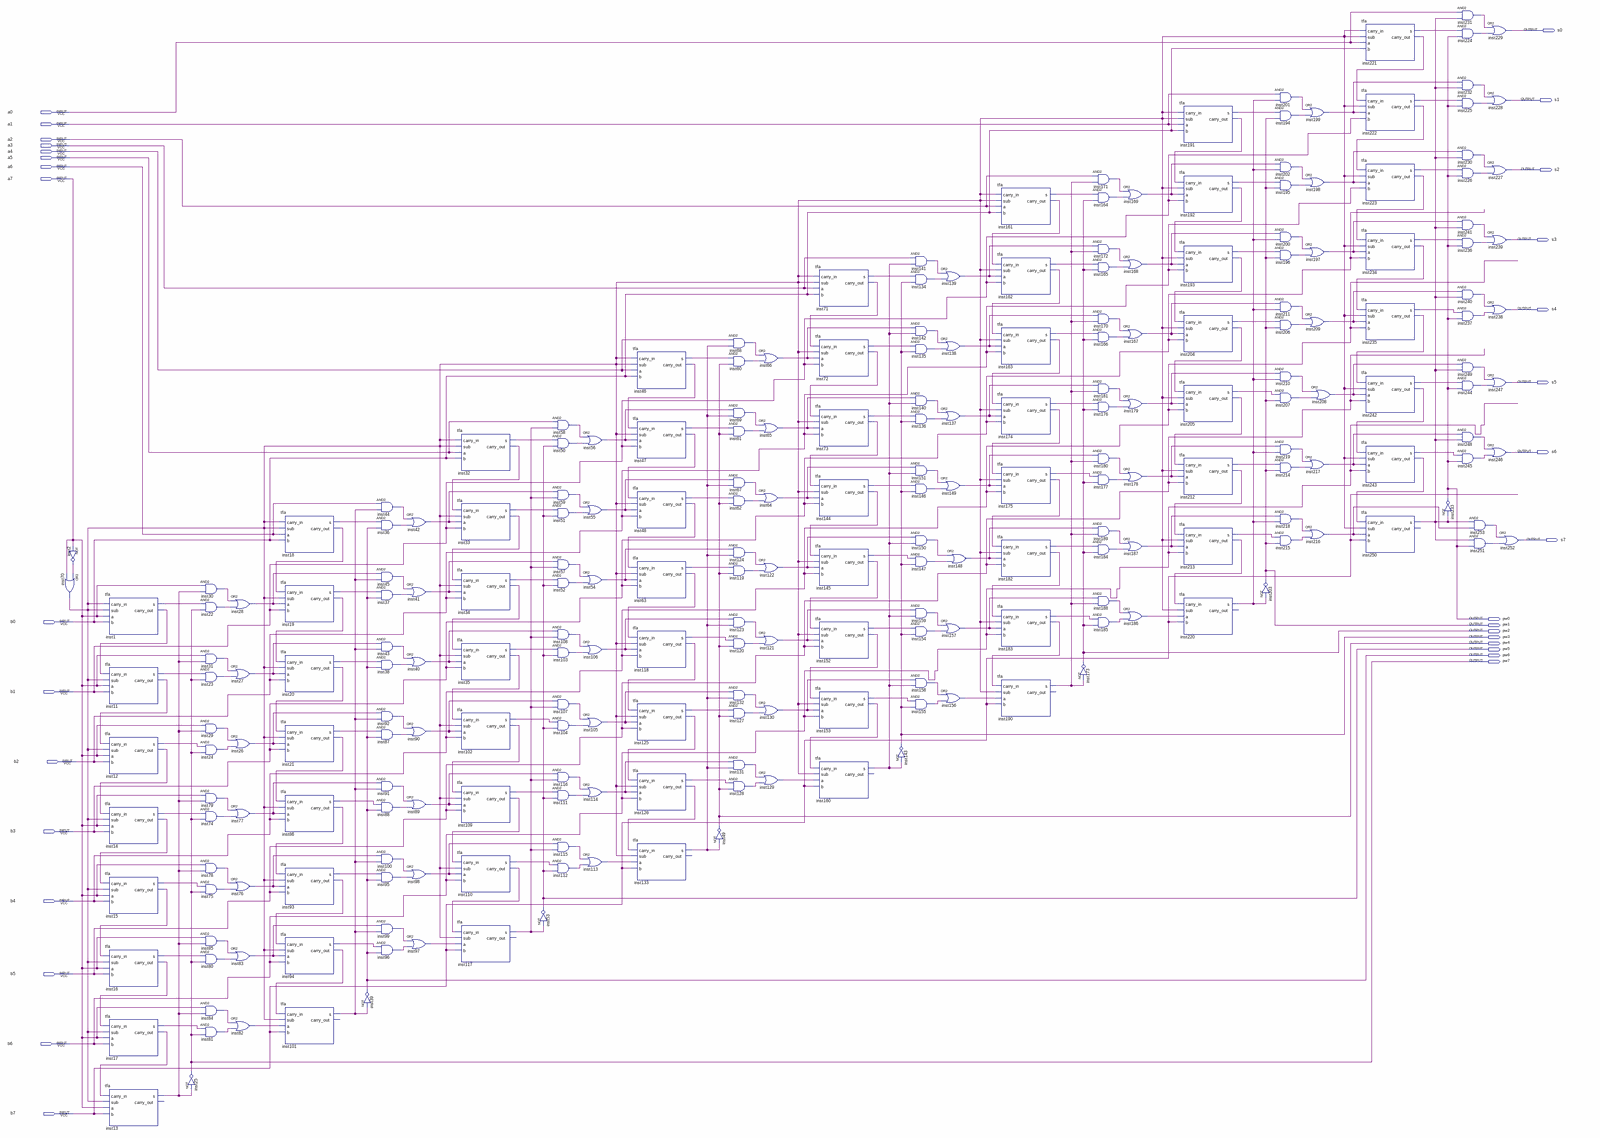
[diagram p0: schematic sheet, whole]
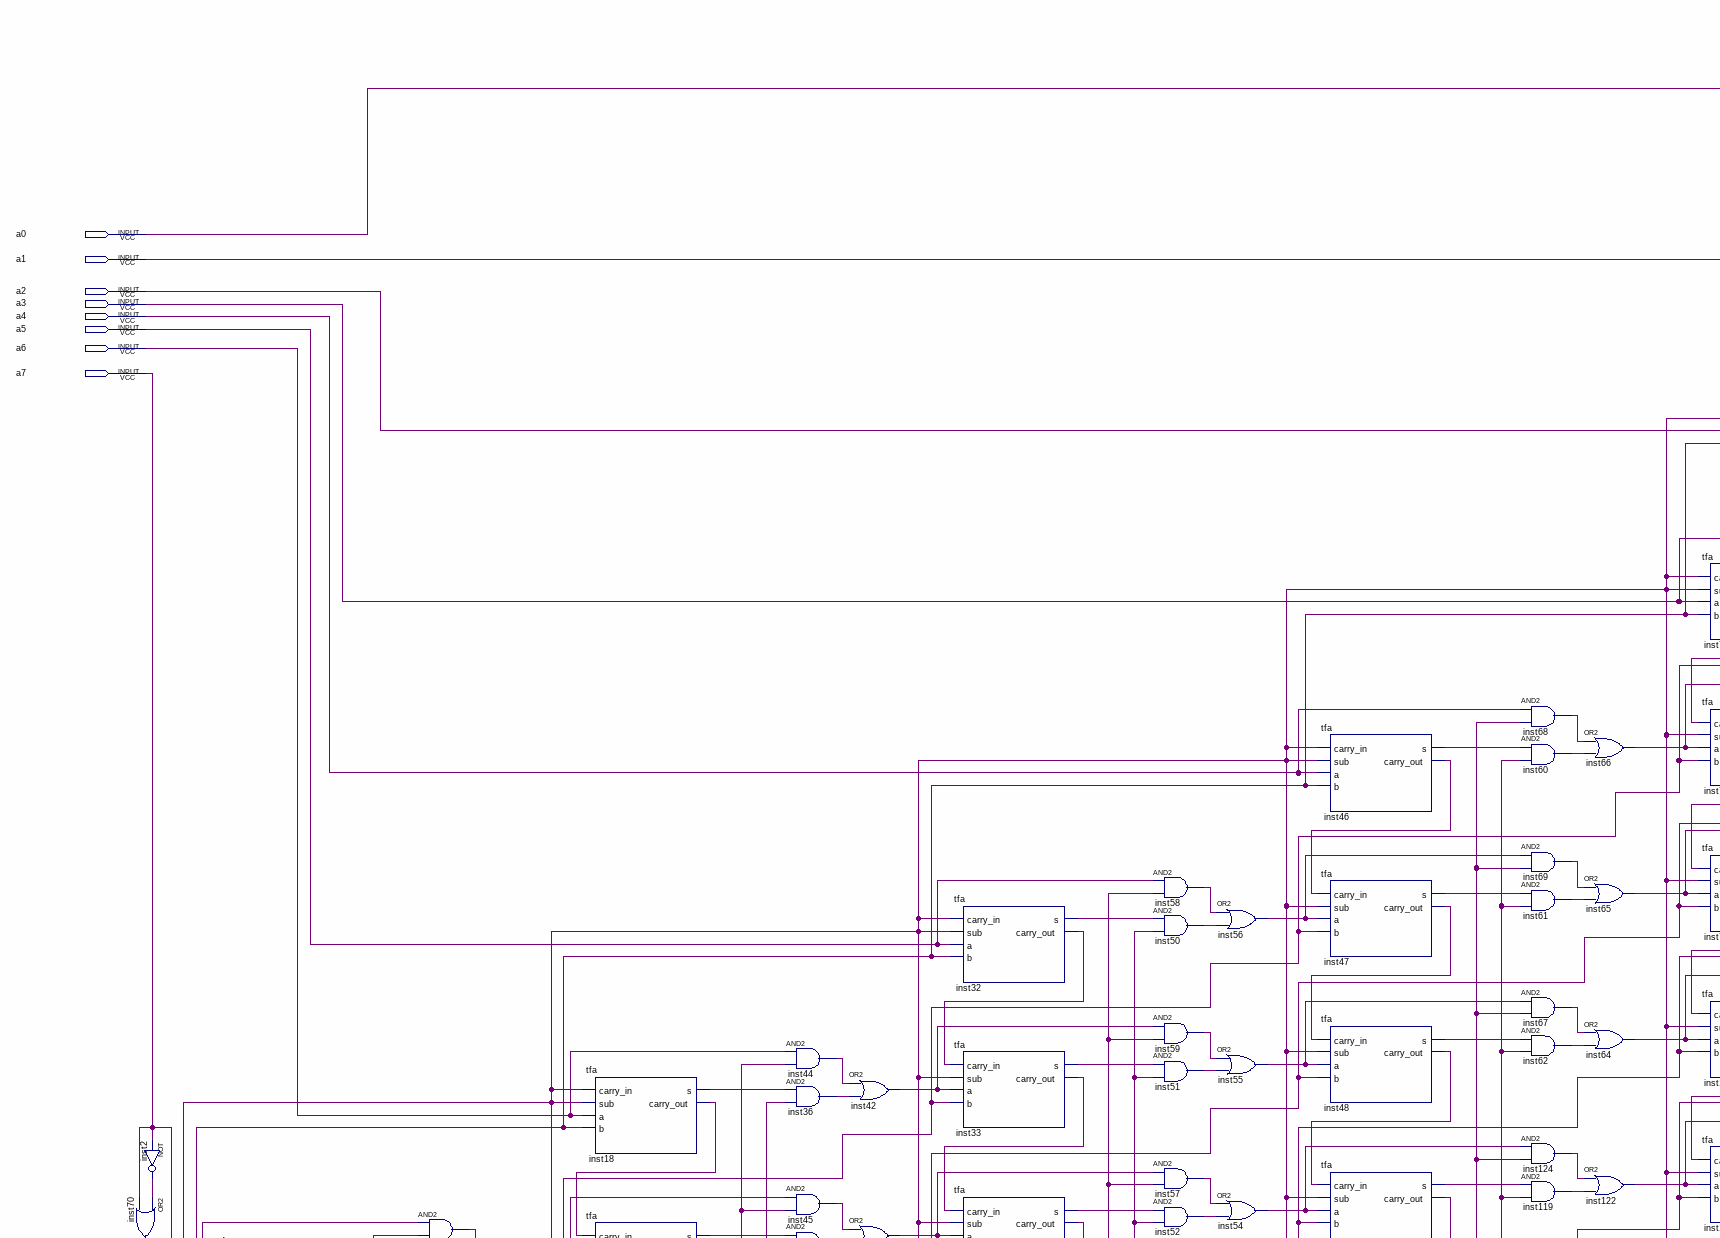
[diagram p1: schematic sheet, upper left part]
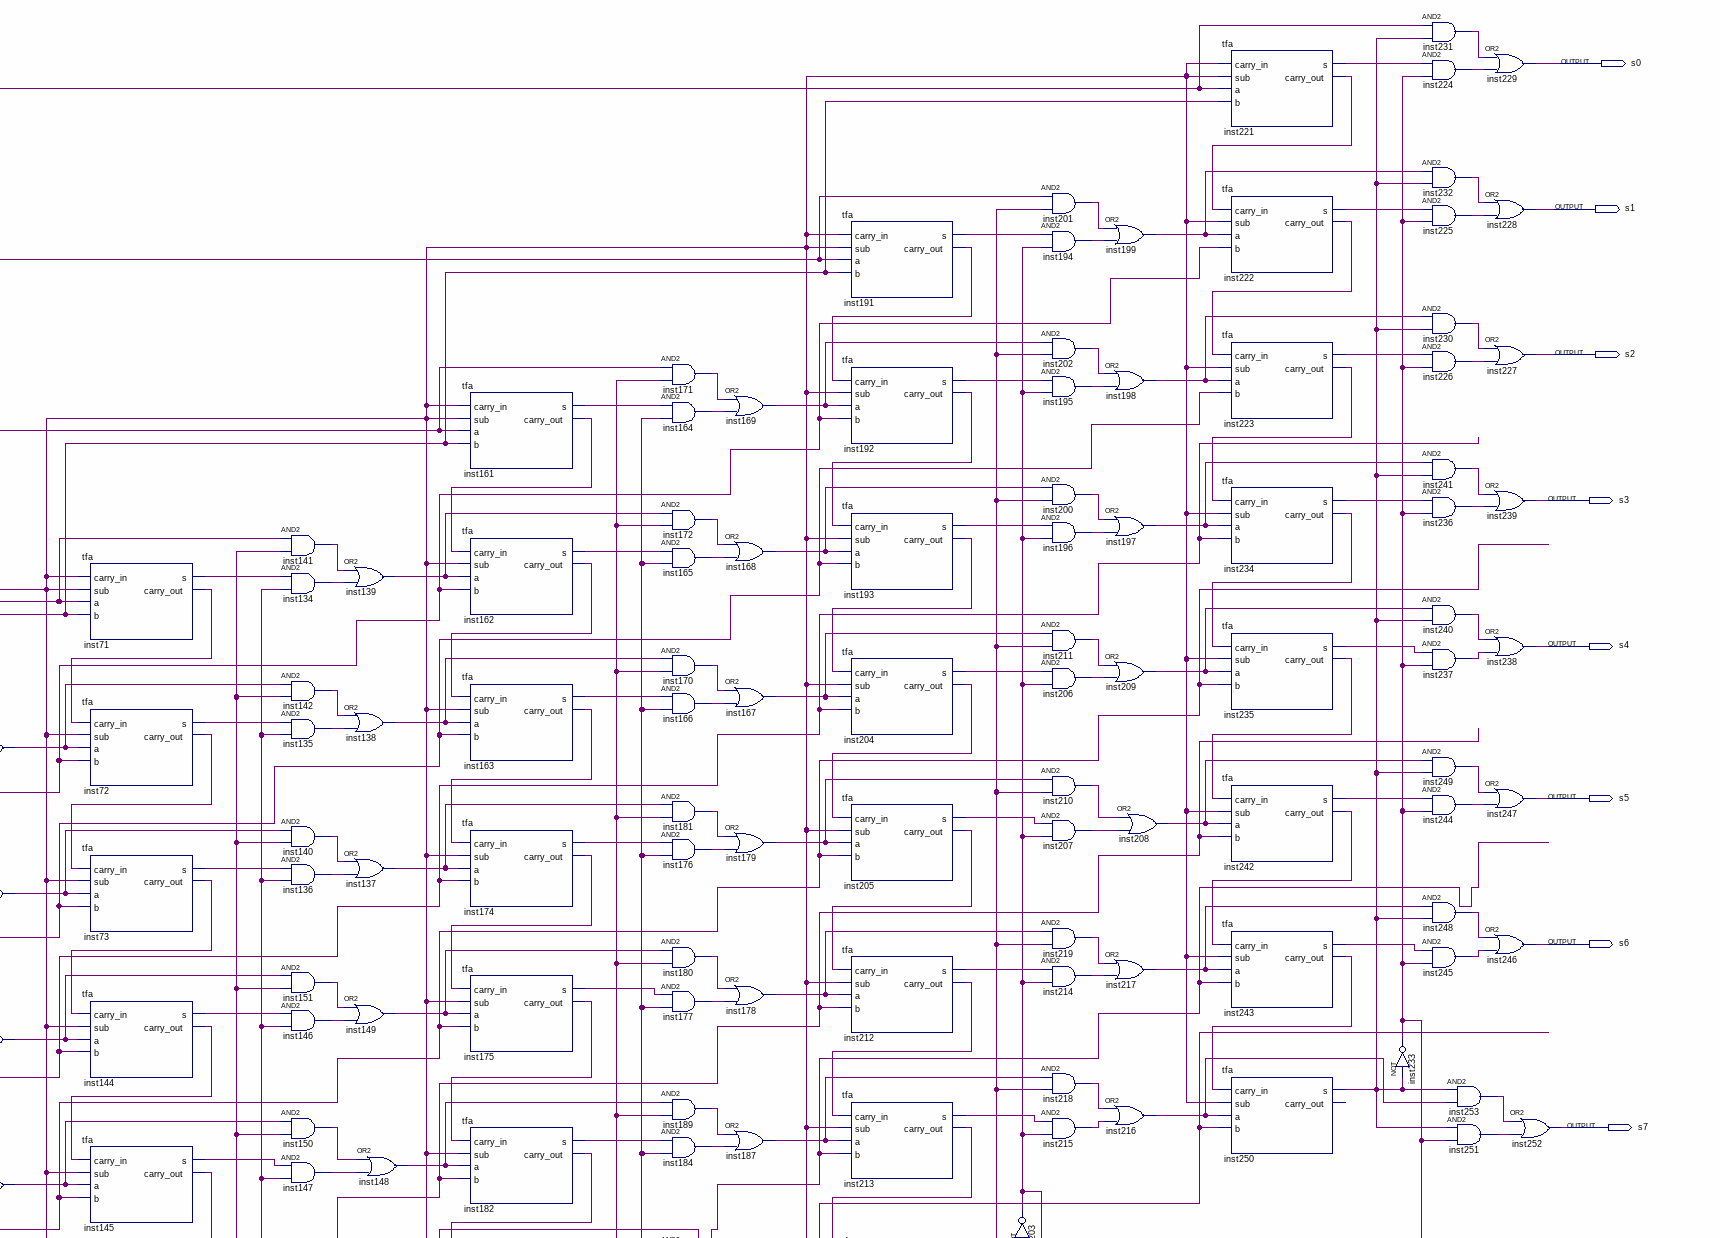
[diagram p2: schematic sheet, upper right part]
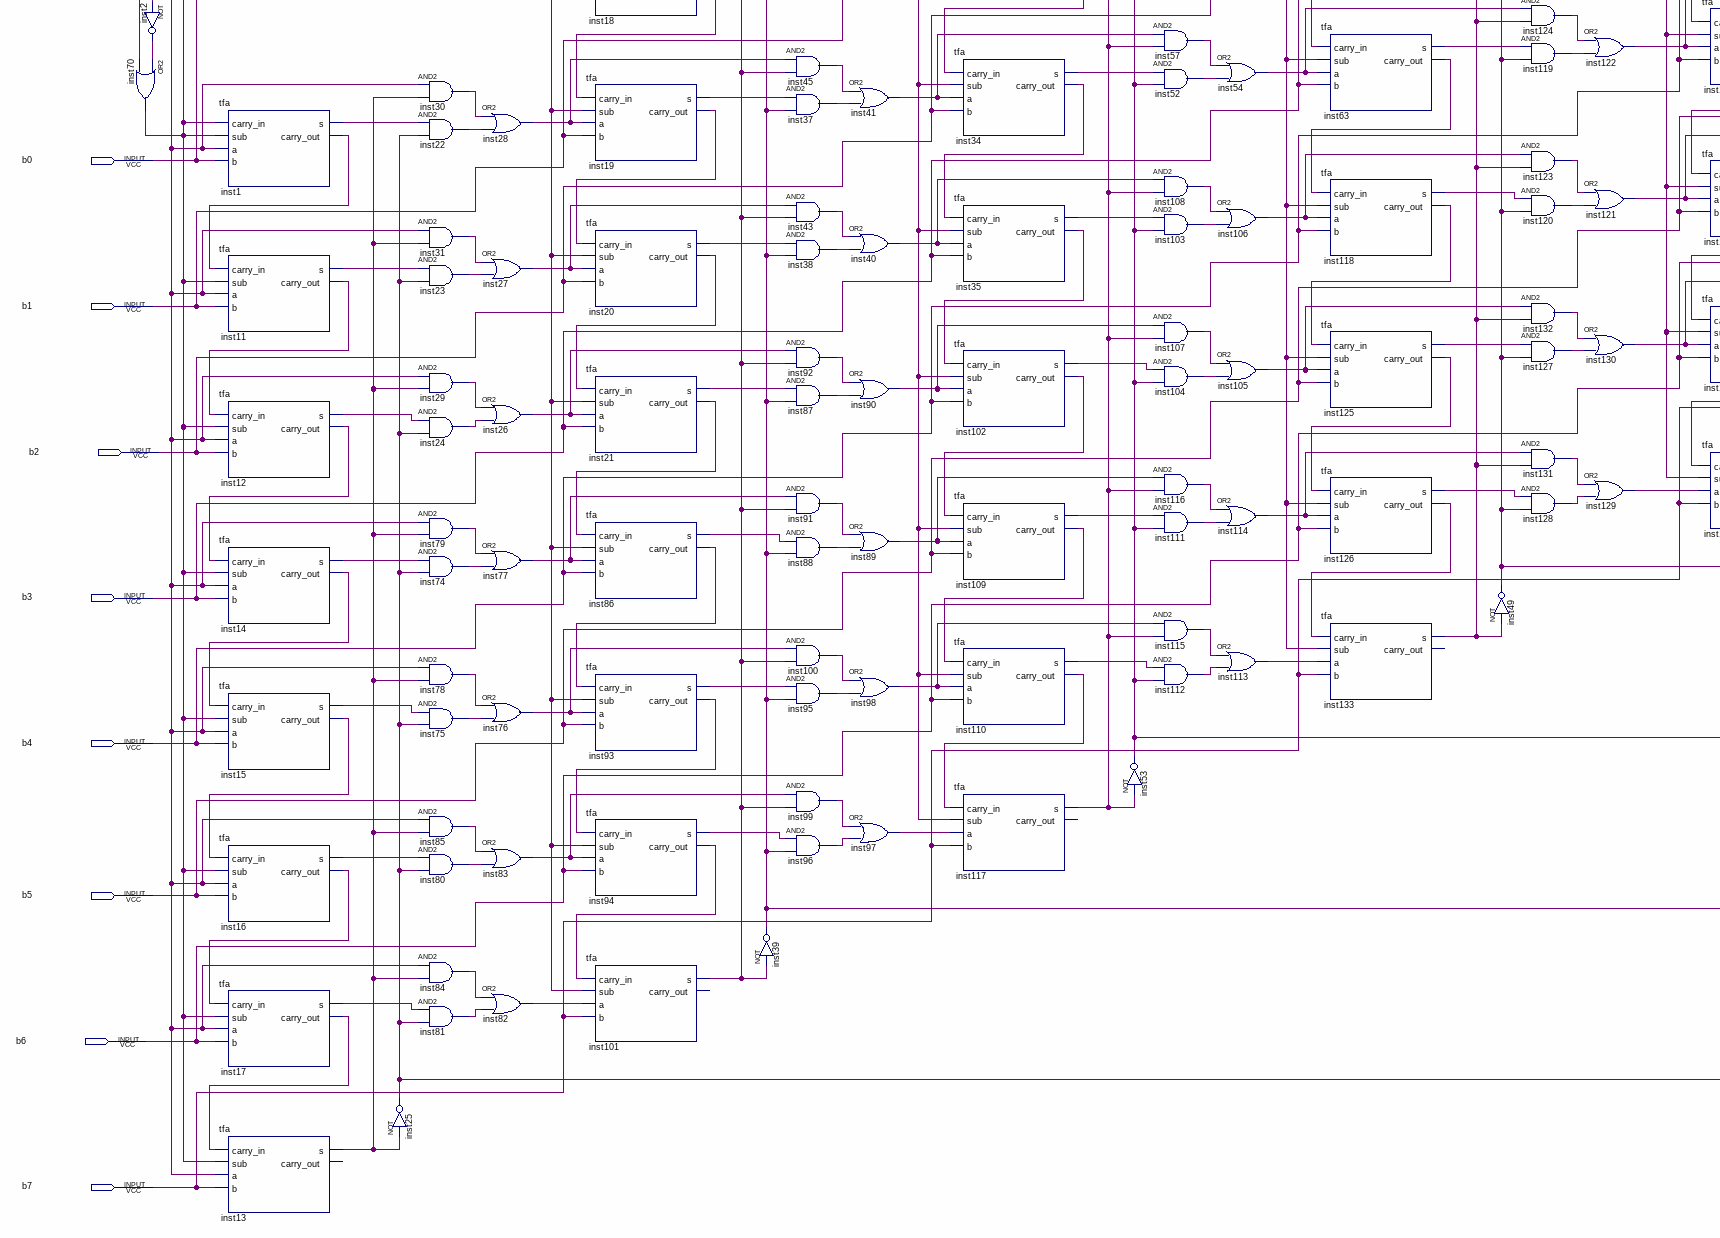
[diagram p3: schematic sheet, lower left part]
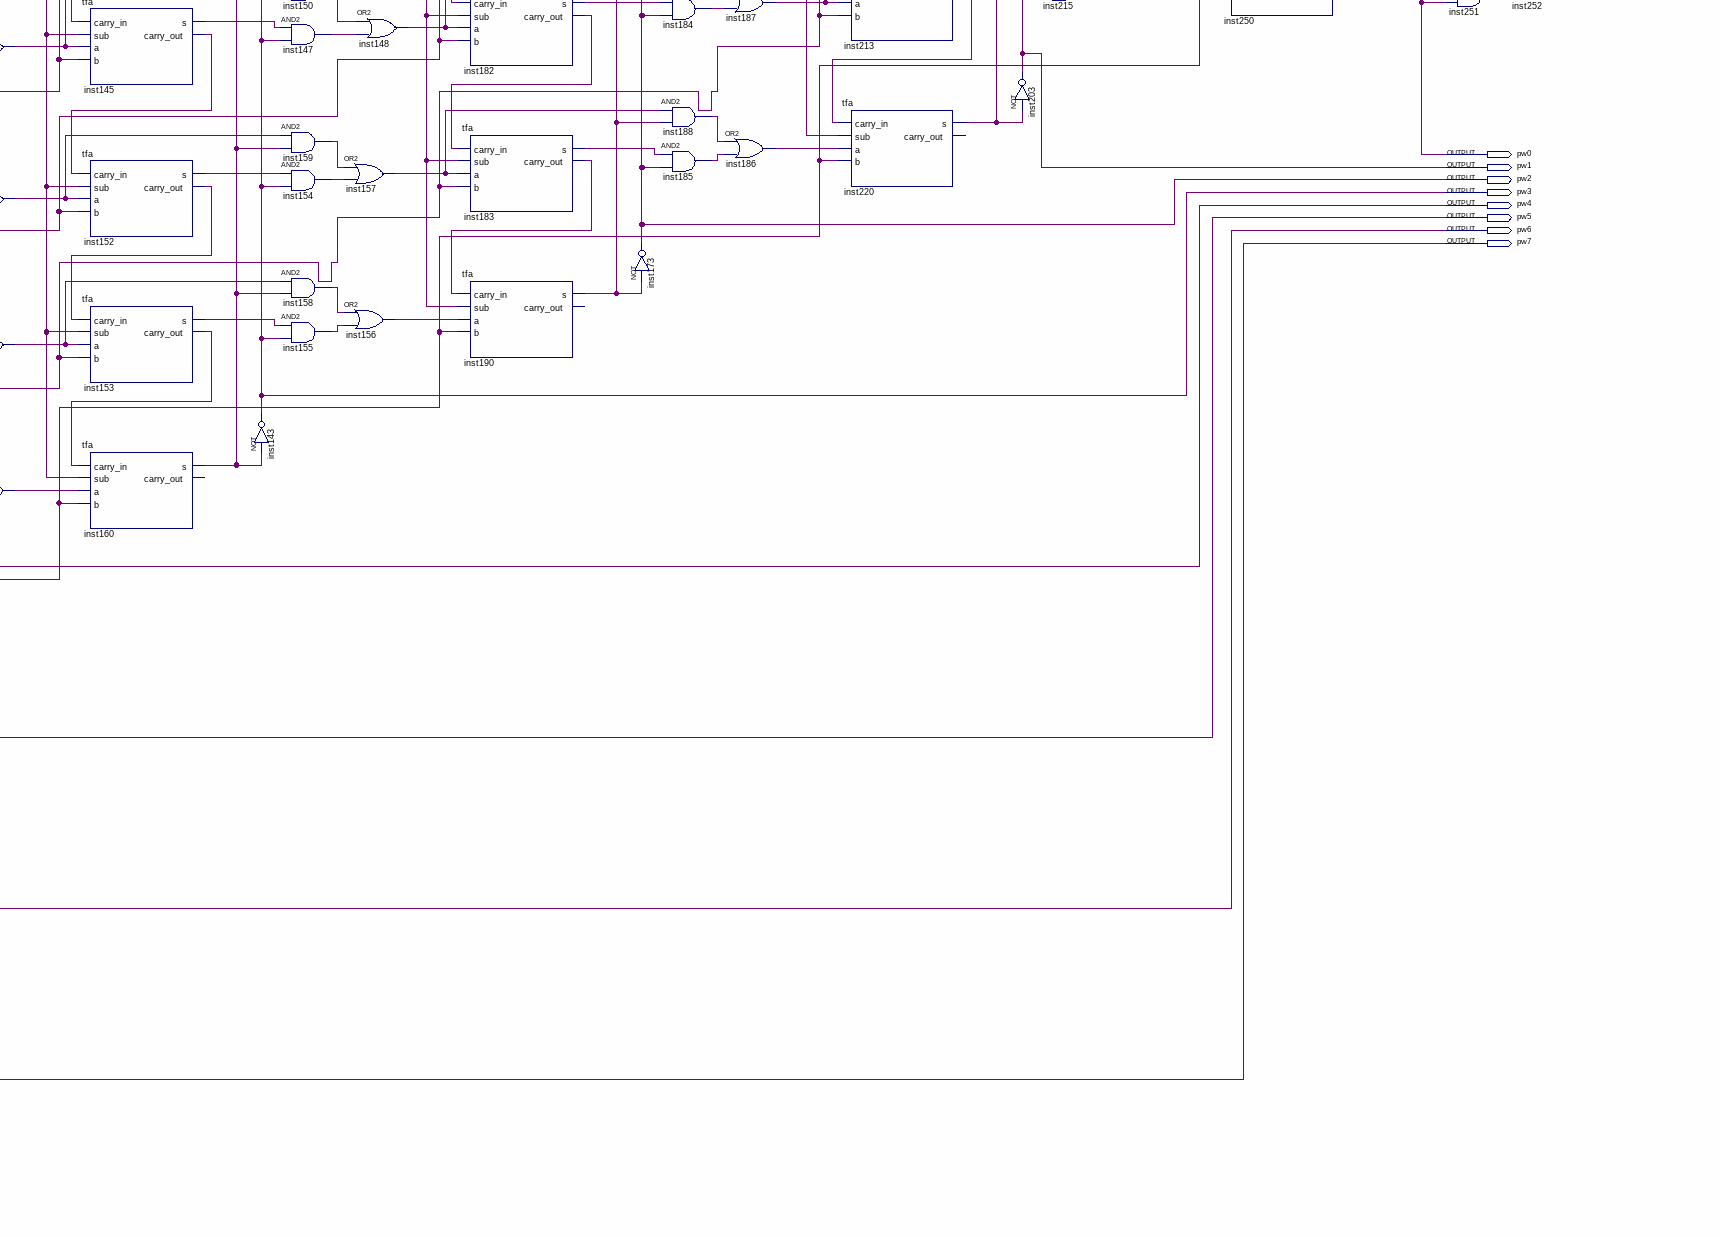
[diagram p4: schematic sheet, lower right part]
// Quartus schematic cfq1.bdf as structural Verilog: 245 symbols, 32 pins
module cfq1 (
  input  a0,
  input  a1,
  input  a2,
  input  a3,
  input  a4,
  input  a5,
  input  a6,
  input  a7,
  input  b0,
  input  b1,
  input  b2,
  input  b3,
  input  b4,
  input  b5,
  input  b6,
  input  b7,
  output s0,
  output s1,
  output s2,
  output s3,
  output s4,
  output s5,
  output s6,
  output s7,
  output pw0,
  output pw1,
  output pw2,
  output pw3,
  output pw4,
  output pw5,
  output pw6,
  output pw7
);

  wire inst1_carry_out, inst1_s, inst2_out, inst11_carry_out, inst11_s, inst12_carry_out, inst12_s, inst13_s,
       inst14_carry_out, inst14_s, inst15_carry_out, inst15_s, inst16_carry_out, inst16_s, inst17_carry_out,
       inst17_s, inst18_carry_out, inst18_s, inst19_carry_out, inst19_s, inst20_carry_out, inst20_s,
       inst21_carry_out, inst21_s, inst22_out, inst23_out, inst24_out, inst26_out, inst27_out, inst28_out,
       inst29_out, inst30_out, inst31_out, inst32_carry_out, inst32_s, inst33_carry_out, inst33_s,
       inst34_carry_out, inst34_s, inst35_carry_out, inst35_s, inst36_out, inst37_out, inst38_out,
       inst40_out, inst41_out, inst42_out, inst43_out, inst44_out, inst45_out, inst46_carry_out, inst46_s,
       inst47_carry_out, inst47_s, inst48_carry_out, inst48_s, inst50_out, inst51_out, inst52_out,
       inst54_out, inst55_out, inst56_out, inst57_out, inst58_out, inst59_out, inst60_out, inst61_out,
       inst62_out, inst63_carry_out, inst63_s, inst64_out, inst65_out, inst66_out, inst67_out, inst68_out,
       inst69_out, inst70_out, inst71_carry_out, inst71_s, inst72_carry_out, inst72_s, inst73_carry_out,
       inst73_s, inst74_out, inst75_out, inst76_out, inst77_out, inst78_out, inst79_out, inst80_out,
       inst81_out, inst82_out, inst83_out, inst84_out, inst85_out, inst86_carry_out, inst86_s, inst87_out,
       inst88_out, inst89_out, inst90_out, inst91_out, inst92_out, inst93_carry_out, inst93_s,
       inst94_carry_out, inst94_s, inst95_out, inst96_out, inst97_out, inst98_out, inst99_out, inst100_out,
       inst101_s, inst102_carry_out, inst102_s, inst103_out, inst104_out, inst105_out, inst106_out,
       inst107_out, inst108_out, inst109_carry_out, inst109_s, inst110_carry_out, inst110_s, inst111_out,
       inst112_out, inst113_out, inst114_out, inst115_out, inst116_out, inst117_s, inst118_carry_out,
       inst118_s, inst119_out, inst120_out, inst121_out, inst122_out, inst123_out, inst124_out,
       inst125_carry_out, inst125_s, inst126_carry_out, inst126_s, inst127_out, inst128_out, inst129_out,
       inst130_out, inst131_out, inst132_out, inst133_s, inst134_out, inst135_out, inst136_out, inst137_out,
       inst138_out, inst139_out, inst140_out, inst141_out, inst142_out, inst144_carry_out, inst144_s,
       inst145_carry_out, inst145_s, inst146_out, inst147_out, inst148_out, inst149_out, inst150_out,
       inst151_out, inst152_carry_out, inst152_s, inst153_carry_out, inst153_s, inst154_out, inst155_out,
       inst156_out, inst157_out, inst158_out, inst159_out, inst160_s, inst161_carry_out, inst161_s,
       inst162_carry_out, inst162_s, inst163_carry_out, inst163_s, inst164_out, inst165_out, inst166_out,
       inst167_out, inst168_out, inst169_out, inst170_out, inst171_out, inst172_out, inst174_carry_out,
       inst174_s, inst175_carry_out, inst175_s, inst176_out, inst177_out, inst178_out, inst179_out,
       inst180_out, inst181_out, inst182_carry_out, inst182_s, inst183_carry_out, inst183_s, inst184_out,
       inst185_out, inst186_out, inst187_out, inst188_out, inst189_out, inst190_s, inst191_carry_out,
       inst191_s, inst192_carry_out, inst192_s, inst193_carry_out, inst193_s, inst194_out, inst195_out,
       inst196_out, inst197_out, inst198_out, inst199_out, inst200_out, inst201_out, inst202_out,
       inst204_carry_out, inst204_s, inst205_carry_out, inst205_s, inst206_out, inst207_out, inst208_out,
       inst209_out, inst210_out, inst211_out, inst212_carry_out, inst212_s, inst213_carry_out, inst213_s,
       inst214_out, inst215_out, inst216_out, inst217_out, inst218_out, inst219_out, inst220_s,
       inst221_carry_out, inst221_s, inst222_carry_out, inst222_s, inst223_carry_out, inst223_s, inst224_out,
       inst225_out, inst226_out, inst230_out, inst231_out, inst232_out, inst234_carry_out, inst234_s,
       inst235_carry_out, inst235_s, inst236_out, inst237_out, inst240_out, inst241_out, inst242_carry_out,
       inst242_s, inst243_carry_out, inst243_s, inst244_out, inst245_out, inst248_out, inst249_out,
       inst250_s, inst251_out, inst253_out;

  or inst70 (inst70_out, inst2_out, a7);
  not inst2 (inst2_out, a7);
  tfa inst1 (.carry_in(inst70_out), .sub(inst70_out), .a(a7), .b(b0), .s(inst1_s), .carry_out(inst1_carry_out));
  tfa inst11 (.carry_in(inst1_carry_out), .sub(inst70_out), .a(a7), .b(b1), .s(inst11_s), .carry_out(inst11_carry_out));
  tfa inst12 (
    .carry_in(inst11_carry_out), .sub(inst70_out), .a(a7), .b(b2), .s(inst12_s), .carry_out(inst12_carry_out));
  tfa inst14 (
    .carry_in(inst12_carry_out), .sub(inst70_out), .a(a7), .b(b3), .s(inst14_s), .carry_out(inst14_carry_out));
  tfa inst15 (
    .carry_in(inst14_carry_out), .sub(inst70_out), .a(a7), .b(b4), .s(inst15_s), .carry_out(inst15_carry_out));
  tfa inst16 (
    .carry_in(inst15_carry_out), .sub(inst70_out), .a(a7), .b(b5), .s(inst16_s), .carry_out(inst16_carry_out));
  tfa inst17 (
    .carry_in(inst16_carry_out), .sub(inst70_out), .a(a7), .b(b6), .s(inst17_s), .carry_out(inst17_carry_out));
  tfa inst13 (.carry_in(inst17_carry_out), .sub(inst70_out), .a(a7), .b(b7), .s(inst13_s));  // open: carry_out
  and inst30 (inst30_out, a7, inst13_s);
  and inst22 (inst22_out, inst1_s, pw7);
  and inst31 (inst31_out, a7, inst13_s);
  and inst23 (inst23_out, inst11_s, pw7);
  and inst29 (inst29_out, a7, inst13_s);
  and inst24 (inst24_out, inst12_s, pw7);
  and inst79 (inst79_out, a7, inst13_s);
  and inst74 (inst74_out, inst14_s, pw7);
  and inst78 (inst78_out, a7, inst13_s);
  and inst75 (inst75_out, inst15_s, pw7);
  and inst85 (inst85_out, a7, inst13_s);
  and inst80 (inst80_out, inst16_s, pw7);
  and inst84 (inst84_out, a7, inst13_s);
  and inst81 (inst81_out, inst17_s, pw7);
  not inst25 (pw7, inst13_s);
  or inst28 (inst28_out, inst30_out, inst22_out);
  or inst27 (inst27_out, inst31_out, inst23_out);
  or inst26 (inst26_out, inst29_out, inst24_out);
  or inst77 (inst77_out, inst79_out, inst74_out);
  or inst76 (inst76_out, inst78_out, inst75_out);
  or inst83 (inst83_out, inst85_out, inst80_out);
  or inst82 (inst82_out, inst84_out, inst81_out);
  tfa inst18 (.carry_in(inst70_out), .sub(inst70_out), .a(a6), .b(b0), .s(inst18_s), .carry_out(inst18_carry_out));
  tfa inst19 (
    .carry_in(inst18_carry_out), .sub(inst70_out), .a(inst28_out), .b(b1), .s(inst19_s),
    .carry_out(inst19_carry_out));
  tfa inst20 (
    .carry_in(inst19_carry_out), .sub(inst70_out), .a(inst27_out), .b(b2), .s(inst20_s),
    .carry_out(inst20_carry_out));
  tfa inst21 (
    .carry_in(inst20_carry_out), .sub(inst70_out), .a(inst26_out), .b(b3), .s(inst21_s),
    .carry_out(inst21_carry_out));
  tfa inst86 (
    .carry_in(inst21_carry_out), .sub(inst70_out), .a(inst77_out), .b(b4), .s(inst86_s),
    .carry_out(inst86_carry_out));
  tfa inst93 (
    .carry_in(inst86_carry_out), .sub(inst70_out), .a(inst76_out), .b(b5), .s(inst93_s),
    .carry_out(inst93_carry_out));
  tfa inst94 (
    .carry_in(inst93_carry_out), .sub(inst70_out), .a(inst83_out), .b(b6), .s(inst94_s),
    .carry_out(inst94_carry_out));
  tfa inst101 (
    .carry_in(inst94_carry_out), .sub(inst70_out), .a(inst82_out), .b(b7), .s(inst101_s));  // open: carry_out
  and inst44 (inst44_out, a6, inst101_s);
  and inst36 (inst36_out, inst18_s, pw6);
  and inst45 (inst45_out, inst28_out, inst101_s);
  and inst37 (inst37_out, inst19_s, pw6);
  and inst43 (inst43_out, inst27_out, inst101_s);
  and inst38 (inst38_out, inst20_s, pw6);
  and inst92 (inst92_out, inst26_out, inst101_s);
  and inst87 (inst87_out, inst21_s, pw6);
  and inst91 (inst91_out, inst77_out, inst101_s);
  and inst88 (inst88_out, inst86_s, pw6);
  and inst100 (inst100_out, inst76_out, inst101_s);
  and inst95 (inst95_out, inst93_s, pw6);
  and inst99 (inst99_out, inst83_out, inst101_s);
  and inst96 (inst96_out, inst94_s, pw6);
  not inst39 (pw6, inst101_s);
  or inst42 (inst42_out, inst44_out, inst36_out);
  or inst41 (inst41_out, inst45_out, inst37_out);
  or inst40 (inst40_out, inst43_out, inst38_out);
  or inst90 (inst90_out, inst92_out, inst87_out);
  or inst89 (inst89_out, inst91_out, inst88_out);
  or inst98 (inst98_out, inst100_out, inst95_out);
  or inst97 (inst97_out, inst99_out, inst96_out);
  tfa inst32 (.carry_in(inst70_out), .sub(inst70_out), .a(a5), .b(b0), .s(inst32_s), .carry_out(inst32_carry_out));
  tfa inst33 (
    .carry_in(inst32_carry_out), .sub(inst70_out), .a(inst42_out), .b(b1), .s(inst33_s),
    .carry_out(inst33_carry_out));
  tfa inst34 (
    .carry_in(inst33_carry_out), .sub(inst70_out), .a(inst41_out), .b(b2), .s(inst34_s),
    .carry_out(inst34_carry_out));
  tfa inst35 (
    .carry_in(inst34_carry_out), .sub(inst70_out), .a(inst40_out), .b(b3), .s(inst35_s),
    .carry_out(inst35_carry_out));
  tfa inst102 (
    .carry_in(inst35_carry_out), .sub(inst70_out), .a(inst90_out), .b(b4), .s(inst102_s),
    .carry_out(inst102_carry_out));
  tfa inst109 (
    .carry_in(inst102_carry_out), .sub(inst70_out), .a(inst89_out), .b(b5), .s(inst109_s),
    .carry_out(inst109_carry_out));
  tfa inst110 (
    .carry_in(inst109_carry_out), .sub(inst70_out), .a(inst98_out), .b(b6), .s(inst110_s),
    .carry_out(inst110_carry_out));
  tfa inst117 (
    .carry_in(inst110_carry_out), .sub(inst70_out), .a(inst97_out), .b(b7), .s(inst117_s));  // open: carry_out
  not inst53 (pw5, inst117_s);
  and inst58 (inst58_out, a5, inst117_s);
  and inst50 (inst50_out, inst32_s, pw5);
  and inst59 (inst59_out, inst42_out, inst117_s);
  and inst51 (inst51_out, inst33_s, pw5);
  and inst57 (inst57_out, inst41_out, inst117_s);
  and inst52 (inst52_out, inst34_s, pw5);
  and inst108 (inst108_out, inst40_out, inst117_s);
  and inst103 (inst103_out, inst35_s, pw5);
  and inst107 (inst107_out, inst90_out, inst117_s);
  and inst104 (inst104_out, inst102_s, pw5);
  and inst116 (inst116_out, inst89_out, inst117_s);
  and inst111 (inst111_out, inst109_s, pw5);
  and inst115 (inst115_out, inst98_out, inst117_s);
  and inst112 (inst112_out, inst110_s, pw5);
  or inst56 (inst56_out, inst58_out, inst50_out);
  or inst55 (inst55_out, inst59_out, inst51_out);
  or inst54 (inst54_out, inst57_out, inst52_out);
  or inst106 (inst106_out, inst108_out, inst103_out);
  or inst105 (inst105_out, inst107_out, inst104_out);
  or inst114 (inst114_out, inst116_out, inst111_out);
  or inst113 (inst113_out, inst115_out, inst112_out);
  tfa inst46 (.carry_in(inst70_out), .sub(inst70_out), .a(a4), .b(b0), .s(inst46_s), .carry_out(inst46_carry_out));
  tfa inst47 (
    .carry_in(inst46_carry_out), .sub(inst70_out), .a(inst56_out), .b(b1), .s(inst47_s),
    .carry_out(inst47_carry_out));
  tfa inst48 (
    .carry_in(inst47_carry_out), .sub(inst70_out), .a(inst55_out), .b(b2), .s(inst48_s),
    .carry_out(inst48_carry_out));
  tfa inst63 (
    .carry_in(inst48_carry_out), .sub(inst70_out), .a(inst54_out), .b(b3), .s(inst63_s),
    .carry_out(inst63_carry_out));
  tfa inst118 (
    .carry_in(inst63_carry_out), .sub(inst70_out), .a(inst106_out), .b(b4), .s(inst118_s),
    .carry_out(inst118_carry_out));
  tfa inst125 (
    .carry_in(inst118_carry_out), .sub(inst70_out), .a(inst105_out), .b(b5), .s(inst125_s),
    .carry_out(inst125_carry_out));
  tfa inst126 (
    .carry_in(inst125_carry_out), .sub(inst70_out), .a(inst114_out), .b(b6), .s(inst126_s),
    .carry_out(inst126_carry_out));
  tfa inst133 (
    .carry_in(inst126_carry_out), .sub(inst70_out), .a(inst113_out), .b(b7), .s(inst133_s));  // open: carry_out
  not inst49 (pw4, inst133_s);
  and inst68 (inst68_out, a4, inst133_s);
  and inst60 (inst60_out, inst46_s, pw4);
  and inst69 (inst69_out, inst56_out, inst133_s);
  and inst61 (inst61_out, inst47_s, pw4);
  and inst67 (inst67_out, inst55_out, inst133_s);
  and inst62 (inst62_out, inst48_s, pw4);
  and inst124 (inst124_out, inst54_out, inst133_s);
  and inst119 (inst119_out, inst63_s, pw4);
  and inst123 (inst123_out, inst106_out, inst133_s);
  and inst120 (inst120_out, inst118_s, pw4);
  and inst132 (inst132_out, inst105_out, inst133_s);
  and inst127 (inst127_out, inst125_s, pw4);
  and inst131 (inst131_out, inst114_out, inst133_s);
  and inst128 (inst128_out, inst126_s, pw4);
  or inst66 (inst66_out, inst68_out, inst60_out);
  or inst65 (inst65_out, inst69_out, inst61_out);
  or inst64 (inst64_out, inst67_out, inst62_out);
  or inst122 (inst122_out, inst124_out, inst119_out);
  or inst121 (inst121_out, inst123_out, inst120_out);
  or inst130 (inst130_out, inst132_out, inst127_out);
  or inst129 (inst129_out, inst131_out, inst128_out);
  tfa inst71 (.carry_in(inst70_out), .sub(inst70_out), .a(a3), .b(b0), .s(inst71_s), .carry_out(inst71_carry_out));
  tfa inst72 (
    .carry_in(inst71_carry_out), .sub(inst70_out), .a(inst66_out), .b(b1), .s(inst72_s),
    .carry_out(inst72_carry_out));
  tfa inst73 (
    .carry_in(inst72_carry_out), .sub(inst70_out), .a(inst65_out), .b(b2), .s(inst73_s),
    .carry_out(inst73_carry_out));
  tfa inst144 (
    .carry_in(inst73_carry_out), .sub(inst70_out), .a(inst64_out), .b(b3), .s(inst144_s),
    .carry_out(inst144_carry_out));
  tfa inst145 (
    .carry_in(inst144_carry_out), .sub(inst70_out), .a(inst122_out), .b(b4), .s(inst145_s),
    .carry_out(inst145_carry_out));
  tfa inst152 (
    .carry_in(inst145_carry_out), .sub(inst70_out), .a(inst121_out), .b(b5), .s(inst152_s),
    .carry_out(inst152_carry_out));
  tfa inst153 (
    .carry_in(inst152_carry_out), .sub(inst70_out), .a(inst130_out), .b(b6), .s(inst153_s),
    .carry_out(inst153_carry_out));
  tfa inst160 (
    .carry_in(inst153_carry_out), .sub(inst70_out), .a(inst129_out), .b(b7), .s(inst160_s));  // open: carry_out
  and inst141 (inst141_out, a3, inst160_s);
  and inst134 (inst134_out, inst71_s, pw3);
  and inst142 (inst142_out, inst66_out, inst160_s);
  and inst135 (inst135_out, inst72_s, pw3);
  and inst140 (inst140_out, inst65_out, inst160_s);
  and inst136 (inst136_out, inst73_s, pw3);
  and inst151 (inst151_out, inst64_out, inst160_s);
  and inst146 (inst146_out, inst144_s, pw3);
  and inst150 (inst150_out, inst122_out, inst160_s);
  and inst147 (inst147_out, inst145_s, pw3);
  and inst159 (inst159_out, inst121_out, inst160_s);
  and inst154 (inst154_out, inst152_s, pw3);
  and inst158 (inst158_out, inst130_out, inst160_s);
  and inst155 (inst155_out, inst153_s, pw3);
  not inst143 (pw3, inst160_s);
  or inst139 (inst139_out, inst141_out, inst134_out);
  or inst138 (inst138_out, inst142_out, inst135_out);
  or inst137 (inst137_out, inst140_out, inst136_out);
  or inst149 (inst149_out, inst151_out, inst146_out);
  or inst148 (inst148_out, inst150_out, inst147_out);
  or inst157 (inst157_out, inst159_out, inst154_out);
  or inst156 (inst156_out, inst158_out, inst155_out);
  tfa inst161 (.carry_in(inst70_out), .sub(inst70_out), .a(a2), .b(b0), .s(inst161_s), .carry_out(inst161_carry_out));
  tfa inst162 (
    .carry_in(inst161_carry_out), .sub(inst70_out), .a(inst139_out), .b(b1), .s(inst162_s),
    .carry_out(inst162_carry_out));
  tfa inst163 (
    .carry_in(inst162_carry_out), .sub(inst70_out), .a(inst138_out), .b(b2), .s(inst163_s),
    .carry_out(inst163_carry_out));
  tfa inst174 (
    .carry_in(inst163_carry_out), .sub(inst70_out), .a(inst137_out), .b(b3), .s(inst174_s),
    .carry_out(inst174_carry_out));
  tfa inst175 (
    .carry_in(inst174_carry_out), .sub(inst70_out), .a(inst149_out), .b(b4), .s(inst175_s),
    .carry_out(inst175_carry_out));
  tfa inst182 (
    .carry_in(inst175_carry_out), .sub(inst70_out), .a(inst148_out), .b(b5), .s(inst182_s),
    .carry_out(inst182_carry_out));
  tfa inst183 (
    .carry_in(inst182_carry_out), .sub(inst70_out), .a(inst157_out), .b(b6), .s(inst183_s),
    .carry_out(inst183_carry_out));
  tfa inst190 (
    .carry_in(inst183_carry_out), .sub(inst70_out), .a(inst156_out), .b(b7), .s(inst190_s));  // open: carry_out
  not inst173 (pw2, inst190_s);
  and inst171 (inst171_out, a2, inst190_s);
  and inst164 (inst164_out, inst161_s, pw2);
  and inst172 (inst172_out, inst139_out, inst190_s);
  and inst165 (inst165_out, inst162_s, pw2);
  and inst170 (inst170_out, inst138_out, inst190_s);
  and inst166 (inst166_out, inst163_s, pw2);
  and inst181 (inst181_out, inst137_out, inst190_s);
  and inst176 (inst176_out, inst174_s, pw2);
  and inst180 (inst180_out, inst149_out, inst190_s);
  and inst177 (inst177_out, inst175_s, pw2);
  and inst189 (inst189_out, inst148_out, inst190_s);
  and inst184 (inst184_out, inst182_s, pw2);
  and inst188 (inst188_out, inst157_out, inst190_s);
  and inst185 (inst185_out, inst183_s, pw2);
  or inst169 (inst169_out, inst171_out, inst164_out);
  or inst168 (inst168_out, inst172_out, inst165_out);
  or inst167 (inst167_out, inst170_out, inst166_out);
  or inst179 (inst179_out, inst181_out, inst176_out);
  or inst178 (inst178_out, inst180_out, inst177_out);
  or inst187 (inst187_out, inst189_out, inst184_out);
  or inst186 (inst186_out, inst188_out, inst185_out);
  tfa inst191 (.carry_in(inst70_out), .sub(inst70_out), .a(a1), .b(b0), .s(inst191_s), .carry_out(inst191_carry_out));
  tfa inst192 (
    .carry_in(inst191_carry_out), .sub(inst70_out), .a(inst169_out), .b(b1), .s(inst192_s),
    .carry_out(inst192_carry_out));
  tfa inst193 (
    .carry_in(inst192_carry_out), .sub(inst70_out), .a(inst168_out), .b(b2), .s(inst193_s),
    .carry_out(inst193_carry_out));
  tfa inst204 (
    .carry_in(inst193_carry_out), .sub(inst70_out), .a(inst167_out), .b(b3), .s(inst204_s),
    .carry_out(inst204_carry_out));
  tfa inst205 (
    .carry_in(inst204_carry_out), .sub(inst70_out), .a(inst179_out), .b(b4), .s(inst205_s),
    .carry_out(inst205_carry_out));
  tfa inst212 (
    .carry_in(inst205_carry_out), .sub(inst70_out), .a(inst178_out), .b(b5), .s(inst212_s),
    .carry_out(inst212_carry_out));
  tfa inst213 (
    .carry_in(inst212_carry_out), .sub(inst70_out), .a(inst187_out), .b(b6), .s(inst213_s),
    .carry_out(inst213_carry_out));
  tfa inst220 (
    .carry_in(inst213_carry_out), .sub(inst70_out), .a(inst186_out), .b(b7), .s(inst220_s));  // open: carry_out
  and inst201 (inst201_out, a1, inst220_s);
  and inst194 (inst194_out, inst191_s, pw1);
  and inst202 (inst202_out, inst169_out, inst220_s);
  and inst195 (inst195_out, inst192_s, pw1);
  and inst200 (inst200_out, inst168_out, inst220_s);
  and inst196 (inst196_out, inst193_s, pw1);
  and inst211 (inst211_out, inst167_out, inst220_s);
  and inst206 (inst206_out, inst204_s, pw1);
  and inst210 (inst210_out, inst179_out, inst220_s);
  and inst207 (inst207_out, inst205_s, pw1);
  and inst219 (inst219_out, inst178_out, inst220_s);
  and inst214 (inst214_out, inst212_s, pw1);
  and inst218 (inst218_out, inst187_out, inst220_s);
  and inst215 (inst215_out, inst213_s, pw1);
  not inst203 (pw1, inst220_s);
  or inst199 (inst199_out, inst201_out, inst194_out);
  or inst198 (inst198_out, inst202_out, inst195_out);
  or inst197 (inst197_out, inst200_out, inst196_out);
  or inst209 (inst209_out, inst211_out, inst206_out);
  or inst208 (inst208_out, inst210_out, inst207_out);
  or inst217 (inst217_out, inst219_out, inst214_out);
  or inst216 (inst216_out, inst218_out, inst215_out);
  tfa inst221 (.carry_in(inst70_out), .sub(inst70_out), .a(a0), .b(b0), .s(inst221_s), .carry_out(inst221_carry_out));
  tfa inst222 (
    .carry_in(inst221_carry_out), .sub(inst70_out), .a(inst199_out), .b(b1), .s(inst222_s),
    .carry_out(inst222_carry_out));
  tfa inst223 (
    .carry_in(inst222_carry_out), .sub(inst70_out), .a(inst198_out), .b(b2), .s(inst223_s),
    .carry_out(inst223_carry_out));
  tfa inst234 (
    .carry_in(inst223_carry_out), .sub(inst70_out), .a(inst197_out), .b(b3), .s(inst234_s),
    .carry_out(inst234_carry_out));
  tfa inst235 (
    .carry_in(inst234_carry_out), .sub(inst70_out), .a(inst209_out), .b(b4), .s(inst235_s),
    .carry_out(inst235_carry_out));
  tfa inst242 (
    .carry_in(inst235_carry_out), .sub(inst70_out), .a(inst208_out), .b(b5), .s(inst242_s),
    .carry_out(inst242_carry_out));
  tfa inst243 (
    .carry_in(inst242_carry_out), .sub(inst70_out), .a(inst217_out), .b(b6), .s(inst243_s),
    .carry_out(inst243_carry_out));
  tfa inst250 (
    .carry_in(inst243_carry_out), .sub(inst70_out), .a(inst216_out), .b(b7), .s(inst250_s));  // open: carry_out
  not inst233 (pw0, inst250_s);
  and inst231 (inst231_out, a0, inst250_s);
  and inst224 (inst224_out, inst221_s, pw0);
  and inst232 (inst232_out, inst199_out, inst250_s);
  and inst225 (inst225_out, inst222_s, pw0);
  and inst230 (inst230_out, inst198_out, inst250_s);
  and inst226 (inst226_out, inst223_s, pw0);
  and inst241 (inst241_out, inst197_out, inst250_s);
  and inst236 (inst236_out, inst234_s, pw0);
  and inst240 (inst240_out, inst209_out, inst250_s);
  and inst237 (inst237_out, inst235_s, pw0);
  and inst249 (inst249_out, inst208_out, inst250_s);
  and inst244 (inst244_out, inst242_s, pw0);
  and inst248 (inst248_out, inst217_out, inst250_s);
  and inst245 (inst245_out, inst243_s, pw0);
  and inst253 (inst253_out, inst250_s, inst216_out);
  and inst251 (inst251_out, inst250_s, pw0);
  or inst229 (s0, inst231_out, inst224_out);
  or inst228 (s1, inst232_out, inst225_out);
  or inst227 (s2, inst230_out, inst226_out);
  or inst239 (s3, inst241_out, inst236_out);
  or inst238 (s4, inst240_out, inst237_out);
  or inst247 (s5, inst249_out, inst244_out);
  or inst246 (s6, inst248_out, inst245_out);
  or inst252 (s7, inst253_out, inst251_out);
endmodule
